# EAGLE schematic mg (EAGLE 6.3)
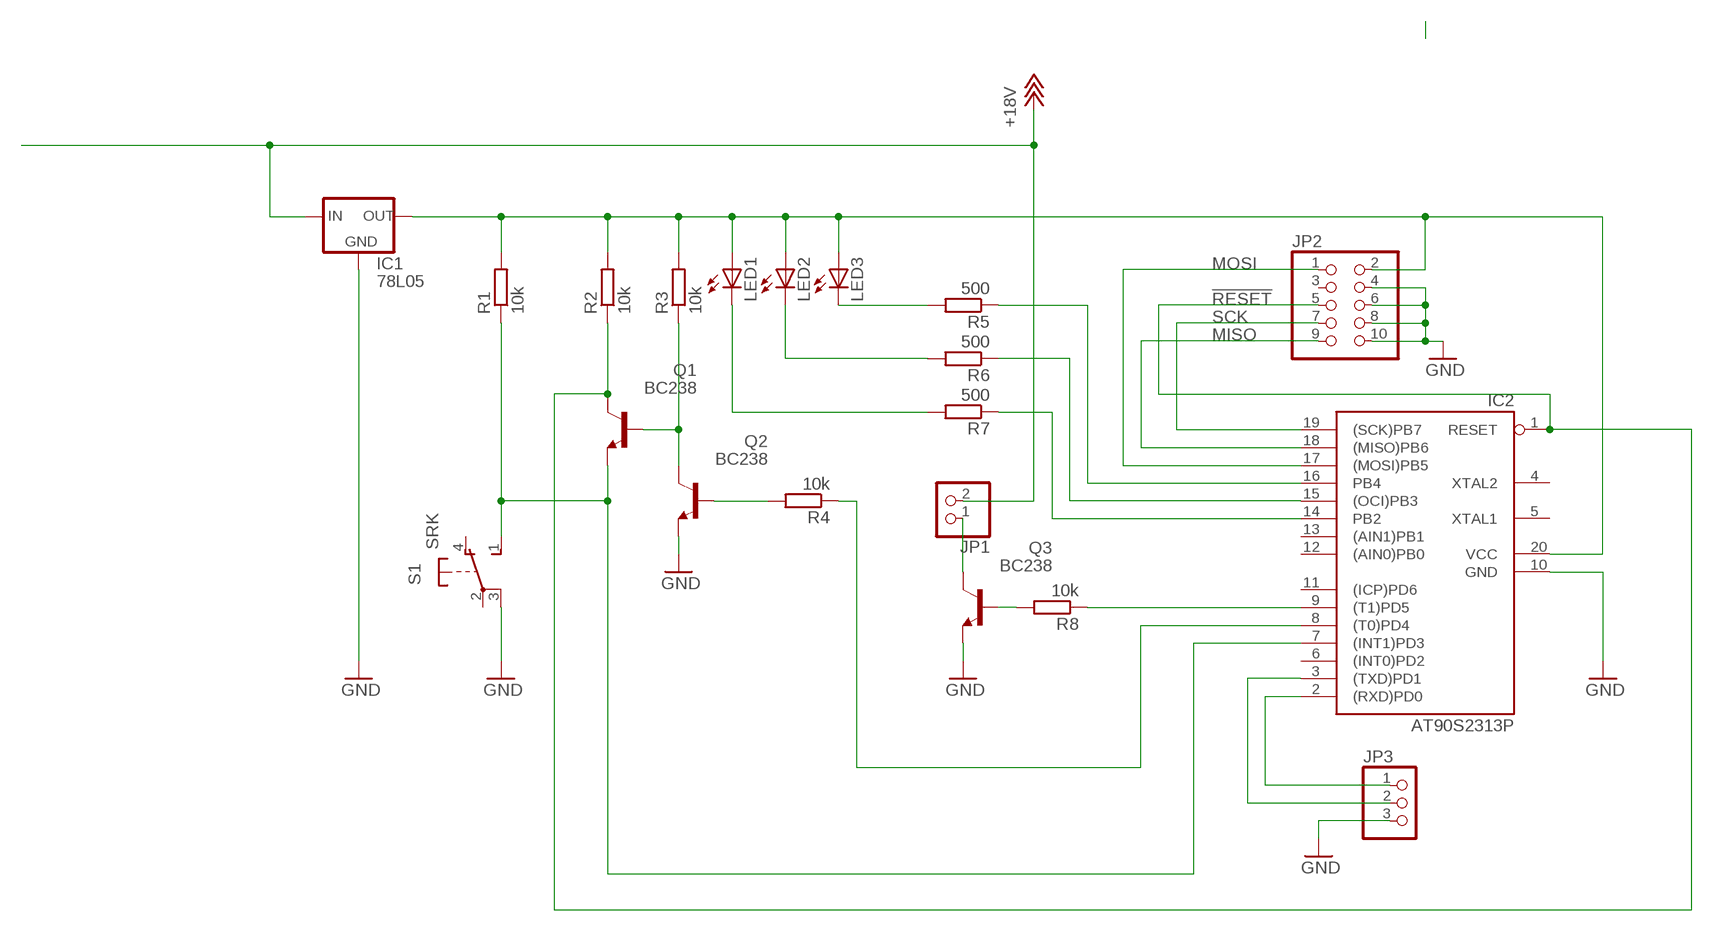
[diagram p0: schematic, sheet 1]

## Parts
IC1  78L05  78LXX  [78LXX]
IC2  AT90S2313P  [DIL20]
JP1  PINHD-1X2  [1X02]
JP2  PINHD-2X5  [2X05]
JP3  PINHD-1X3  [1X03]
LED1  LED5MM  [LED5MM]
LED2  LED5MM  [LED5MM]
LED3  LED5MM  [LED5MM]
Q1  BC238  [TO92]
Q2  BC238  [TO92]
Q3  BC238  [TO92]
R1  10k  R-EU_0309/12  [0309/12]
R2  10k  R-EU_0309/12  [0309/12]
R3  10k  R-EU_0309/12  [0309/12]
R4  10k  R-EU_0309/12  [0309/12]
R5  500  R-EU_0309/12  [0309/12]
R6  500  R-EU_0309/12  [0309/12]
R7  500  R-EU_0309/12  [0309/12]
R8  10k  R-EU_0309/12  [0309/12]
S1  SRK  [SRK]

## Nets
!RESET: IC2.1(RESET) JP2.5 Q1.3(C) R2.1
+5V: IC1.OUT IC2.20(VCC) JP2.2 LED1.A LED2.A LED3.A R1.2 R2.2 R3.2
+18V: IC1.IN JP1.2
GND: IC1.GND IC2.10(GND) JP2.4 JP2.6 JP2.8 JP2.10 JP3.3 Q2.1(E) Q3.1(E) S1.3(P)
MISO: IC2.18((MISO)PB6) JP2.9
MOSI: IC2.17((MOSI)PB5) JP2.1
N$2: Q1.2(B) Q2.3(C) R3.1
N$4: IC2.7((INT1)PD3) Q1.1(E) R1.1 S1.1(S)
N$6: Q2.2(B) R4.2
N$7: IC2.9((T1)PD5) R8.1
N$8: IC2.16(PB4) R5.1
N$9: IC2.15((OCI)PB3) R6.1
N$10: LED3.K(C) R5.2
N$11: IC2.14(PB2) R7.1
N$12: Q3.2(B) R8.2
N$14: JP1.1 Q3.3(C)
N$15: LED2.K(C) R6.2
N$16: LED1.K(C) R7.2
N$17: IC2.8((T0)PD4) R4.1
N$20: IC2.3((TXD)PD1) JP3.2
N$21: IC2.2((RXD)PD0) JP3.1
SCK: IC2.19((SCK)PB7) JP2.7
Unconnected: IC2.4(XTAL2) IC2.5(XTAL1) IC2.6((INT0)PD2) IC2.11((ICP)PD6) IC2.12((AIN0)PB0) IC2.13((AIN1)PB1) JP2.3 S1.2(P) S1.4(O)

## Library data of the parts
IC1 = v-reg:78LXX: VOLTAGE REGULATOR
IC2 = atmel:AT90S2313: MICROCONTROLLER 2 Kbytes FLASH 128 bytes SRAM 128 bytes EEPROM UART; OC_FARNELL: unknown; OC_NEWARK: unknown
JP1 = pinhead:PINHD-1X2: PIN HEADER
JP2 = pinhead:PINHD-2X5: PIN HEADER
JP3 = pinhead:PINHD-1X3: PIN HEADER
LED1-LED3 = led:LED: LED OSRAM: - CHIPLED LG R971, LG N971, LY N971, LG Q971, LY Q971, LO R971, LY R971 LH N974, LH R974 LS Q976, LO Q976, LY Q976 LO Q996 - Hyper CHIPLED LW Q18S LB Q993, LB Q99A, LB R99A - SideLED LS A670, LO A670, LY A670, LG A670, LP A670 LB A673, LV A673, LT A673, LW A673 LH A674 LY A675 LS A676, LA A676, LO A676, LY A676, LW A676 LS A679, LY A679, LG A679 - Hyper Micro SIDELED® LS Y876, LA Y876, LO Y876, LY Y876 LT Y87S - SmartLED LW L88C, LW L88S LB L89C, LB L89S, LG L890 LS L89K, LO L89K, LY L89K LS L896, LA L896, LO L896, LY L896 - TOPLED LS T670, LO T670, LY T670, LG T670, LP T670 LSG T670, LSP T670, LSY T670, LOP T670, LYG T670 LG T671, LOG T671, LSG T671 LB T673, LV T673, LT T673, LW T673 LH T674 LS T676, LA T676, LO T676, LY T676, LB T676, LH T676, LSB T676, LW T676 LB T67C, LV T67C, LT T67C, LS T67K, LO T67K, LY T67K, LW E67C LS E67B, LA E67B, LO E67B, LY E67B, LB E67C, LV E67C, LT E67C LW T67C LS T679, LY T679, LG T679 LS T770, LO T770, LY T770, LG T770, LP T770 LB T773, LV T773, LT T773, LW T773 LH T774 LS E675, LA E675, LY E675, LS T675 LS T776, LA T776, LO T776, LY T776, LB T776 LHGB T686 LT T68C, LB T68C - Hyper Mini TOPLED® LB M676 - Mini TOPLED Santana® LG M470 LS M47K, LO M47K, LY M47K Source: http://www.osram.convergy.de LUXEON: - LUMILED® LXK2-PW12-R00, LXK2-PW12-S00, LXK2-PW14-U00, LXK2-PW14-V00 LXK2-PM12-R00, LXK2-PM12-S00, LXK2-PM14-U00 LXK2-PE12-Q00, LXK2-PE12-R00, LXK2-PE12-S00, LXK2-PE14-T00, LXK2-PE14-U00 LXK2-PB12-K00, LXK2-PB12-L00, LXK2-PB12-M00, LXK2-PB14-N00, LXK2-PB14-P00, LXK2-PB14-Q00 LXK2-PR12-L00, LXK2-PR12-M00, LXK2-PR14-Q00, LXK2-PR14-R00 LXK2-PD12-Q00, LXK2-PD12-R00, LXK2-PD12-S00 LXK2-PH12-R00, LXK2-PH12-S00 LXK2-PL12-P00, LXK2-PL12-Q00, LXK2-PL12-R00 Source: www.luxeon.com KINGBRIGHT: KA-3528ASYC Source: www.kingbright.com
Q1-Q3 = transistor-npn:BC238: NPN Transistor
R1-R8 = resistor:R-EU_: RESISTOR, European symbol
S1 = switch-misc:SRK: SWITCH